# Altium schematic sheet Afficheur.SchDoc
size A4
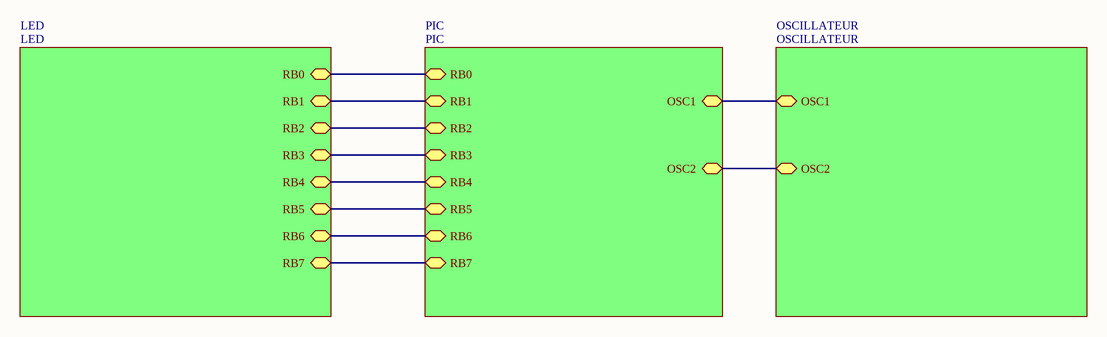
[diagram p0: Afficheur.SchDoc]

## Sub-sheets
LED = LED: RB0, RB1, RB2, RB3, RB4, RB5, RB6, RB7
OSCILLATEUR = OSCILLATEUR: OSC1, OSC2
PIC = PIC: RB0, RB1, RB2, RB3, RB4, RB5, RB6, RB7, OSC1, OSC2

## Nets
(unnamed): sheet PIC/RB0, sheet LED/RB0
(unnamed): sheet PIC/RB1, sheet LED/RB1
(unnamed): sheet PIC/RB2, sheet LED/RB2
(unnamed): sheet PIC/RB3, sheet LED/RB3
(unnamed): sheet PIC/RB4, sheet LED/RB4
(unnamed): sheet PIC/RB5, sheet LED/RB5
(unnamed): sheet PIC/RB6, sheet LED/RB6
(unnamed): sheet PIC/RB7, sheet LED/RB7
(unnamed): sheet PIC/OSC1, sheet OSCILLATEUR/OSC1
(unnamed): sheet PIC/OSC2, sheet OSCILLATEUR/OSC2